# Altium schematic sheet POWER.SchDoc
size A; SheetNumber: 2; SheetTotal: 7
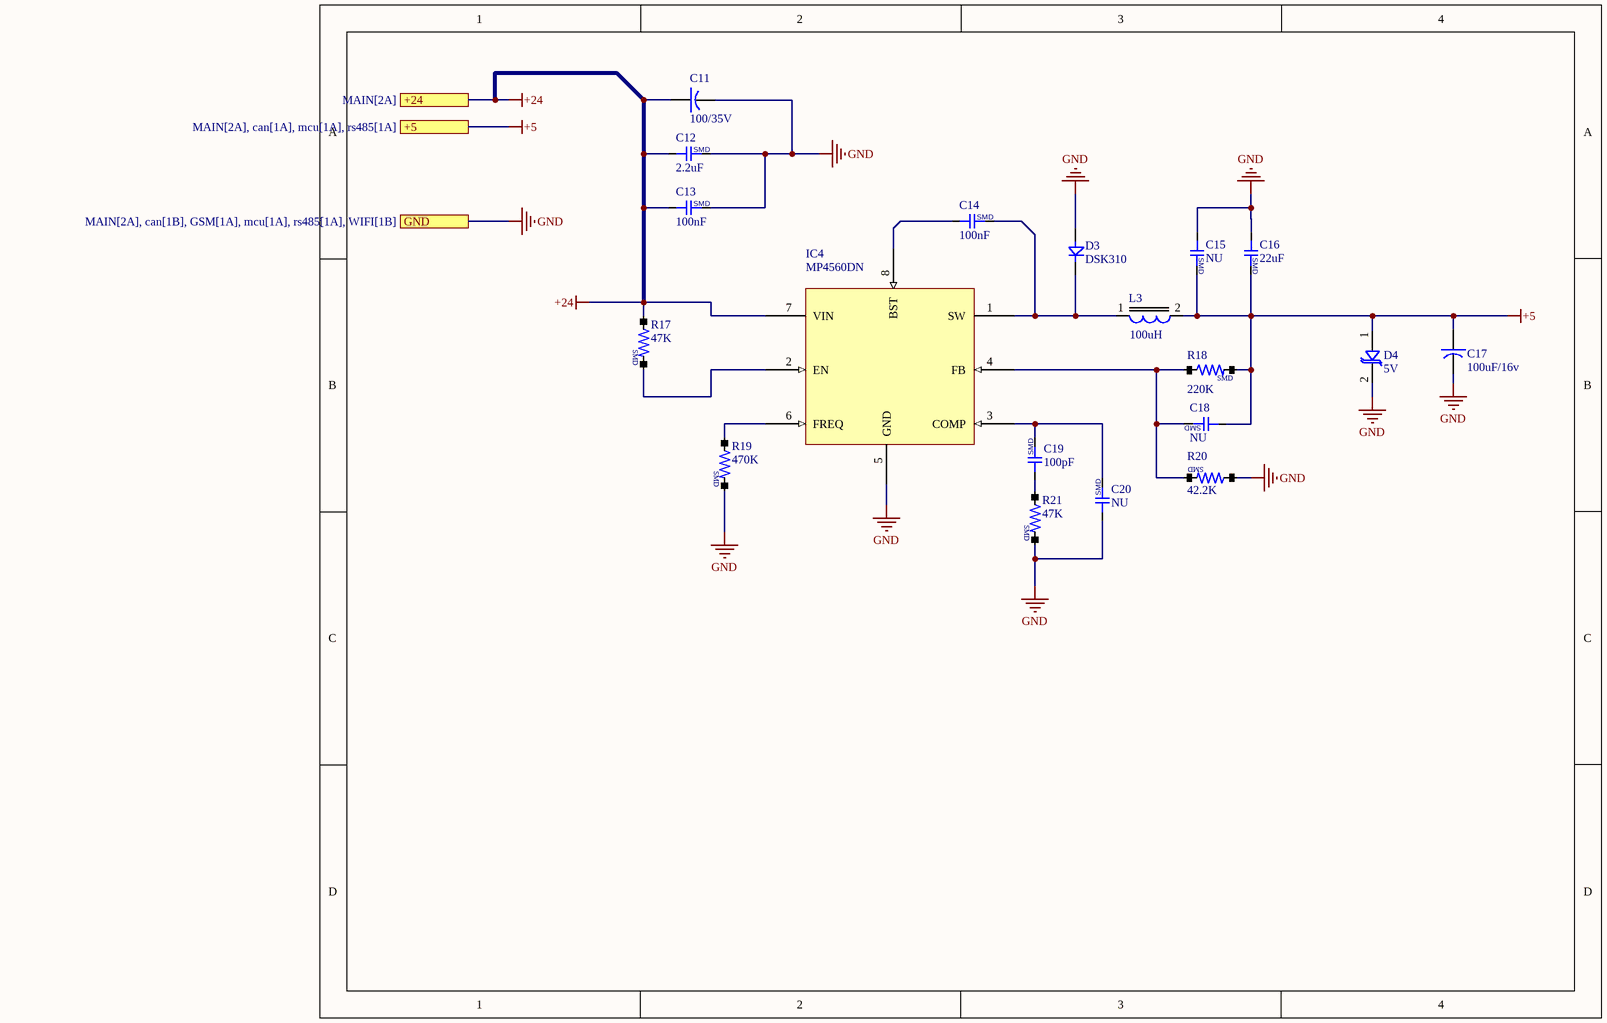
[diagram p0: POWER.SchDoc]

## Parts
C11  100/35V  [cap/330u/16v]
C12  2.2uF  [CAP-0805]
C13  100nF  [CAP-0603]
C14  100nF  [CAP-0603]
C15  NU  [CAP-1206]
C16  22uF  [CAP-1206]
C17  100uF/16v  [cap/330u/16v]
C18  NU  [CAP-0603]
C19  100pF  [CAP-0603]
C20  NU  [CAP-0603]
D3  DSK310  [DIOD/1N4007/SMD]
D4  5V  [TVS-5V-SMD]
IC4  MP4560DN  [SOP8_HIT]
L3  100uH  [inductor-9*12]
R17  47K  [RES/0603]
R18  220K  [RES/0603]
R19  470K  [RES/0603]
R20  42.2K  [RES/0603]
R21  47K  [RES/0603]

## Ports
+5 (see MAIN[2A], can[1A], mcu[1A], rs485[1A]), +24 (see MAIN[2A]), GND (see MAIN[2A], can[1B], GSM[1A], mcu[1A], rs485[1A], WIFI[1B])

## Nets
+5: C15.2 C16.2 C17.+ C18.1 D4.1 L3.2 R18.2 ; port +5
+24: C11.+ C12.1 C13.1 IC4.7(VIN) R17.1 ; port +24
GND: C11.- C12.2 C13.2 C15.1 C16.1 C17.- C20.1 D3.A D4.2 IC4.5(GND) R19.2 R20.1 R21.2 ; port GND
NetC14_1: C14.1 IC4.8(BST)
NetC14_2: C14.2 D3.K IC4.1(SW) L3.1
NetC18_2: C18.2 IC4.4(FB) R18.1 R20.2
NetC19_1: C19.1 R21.1
NetC19_2: C19.2 C20.2 IC4.3(COMP)
NetIC4_2: IC4.2(EN) R17.2
NetIC4_6: IC4.6(FREQ) R19.1

## Notes on the sheet
- (in symbol cap_smd) SMD
- (in symbol RES/SMD) SMD

## Library data of the parts
C11 C17 = cap-electrolit
C12-C16 C18-C20 = cap_smd
D3 = DIOD/RECTIFIERS
D4 = TVS-SMD
L3 = inductor
R17-R21 = RES/SMD